# EAGLE schematic Politeitonsirene_V1 (EAGLE 7.7.0)
ABTEILUNG: Technische Informatik; BEARBEITER: Andrej Tica; DOKUMENTART: Schaltplan; GEZ: TicA; ID: 2AHEL; STATUS: Prototyp; VER: 1.0
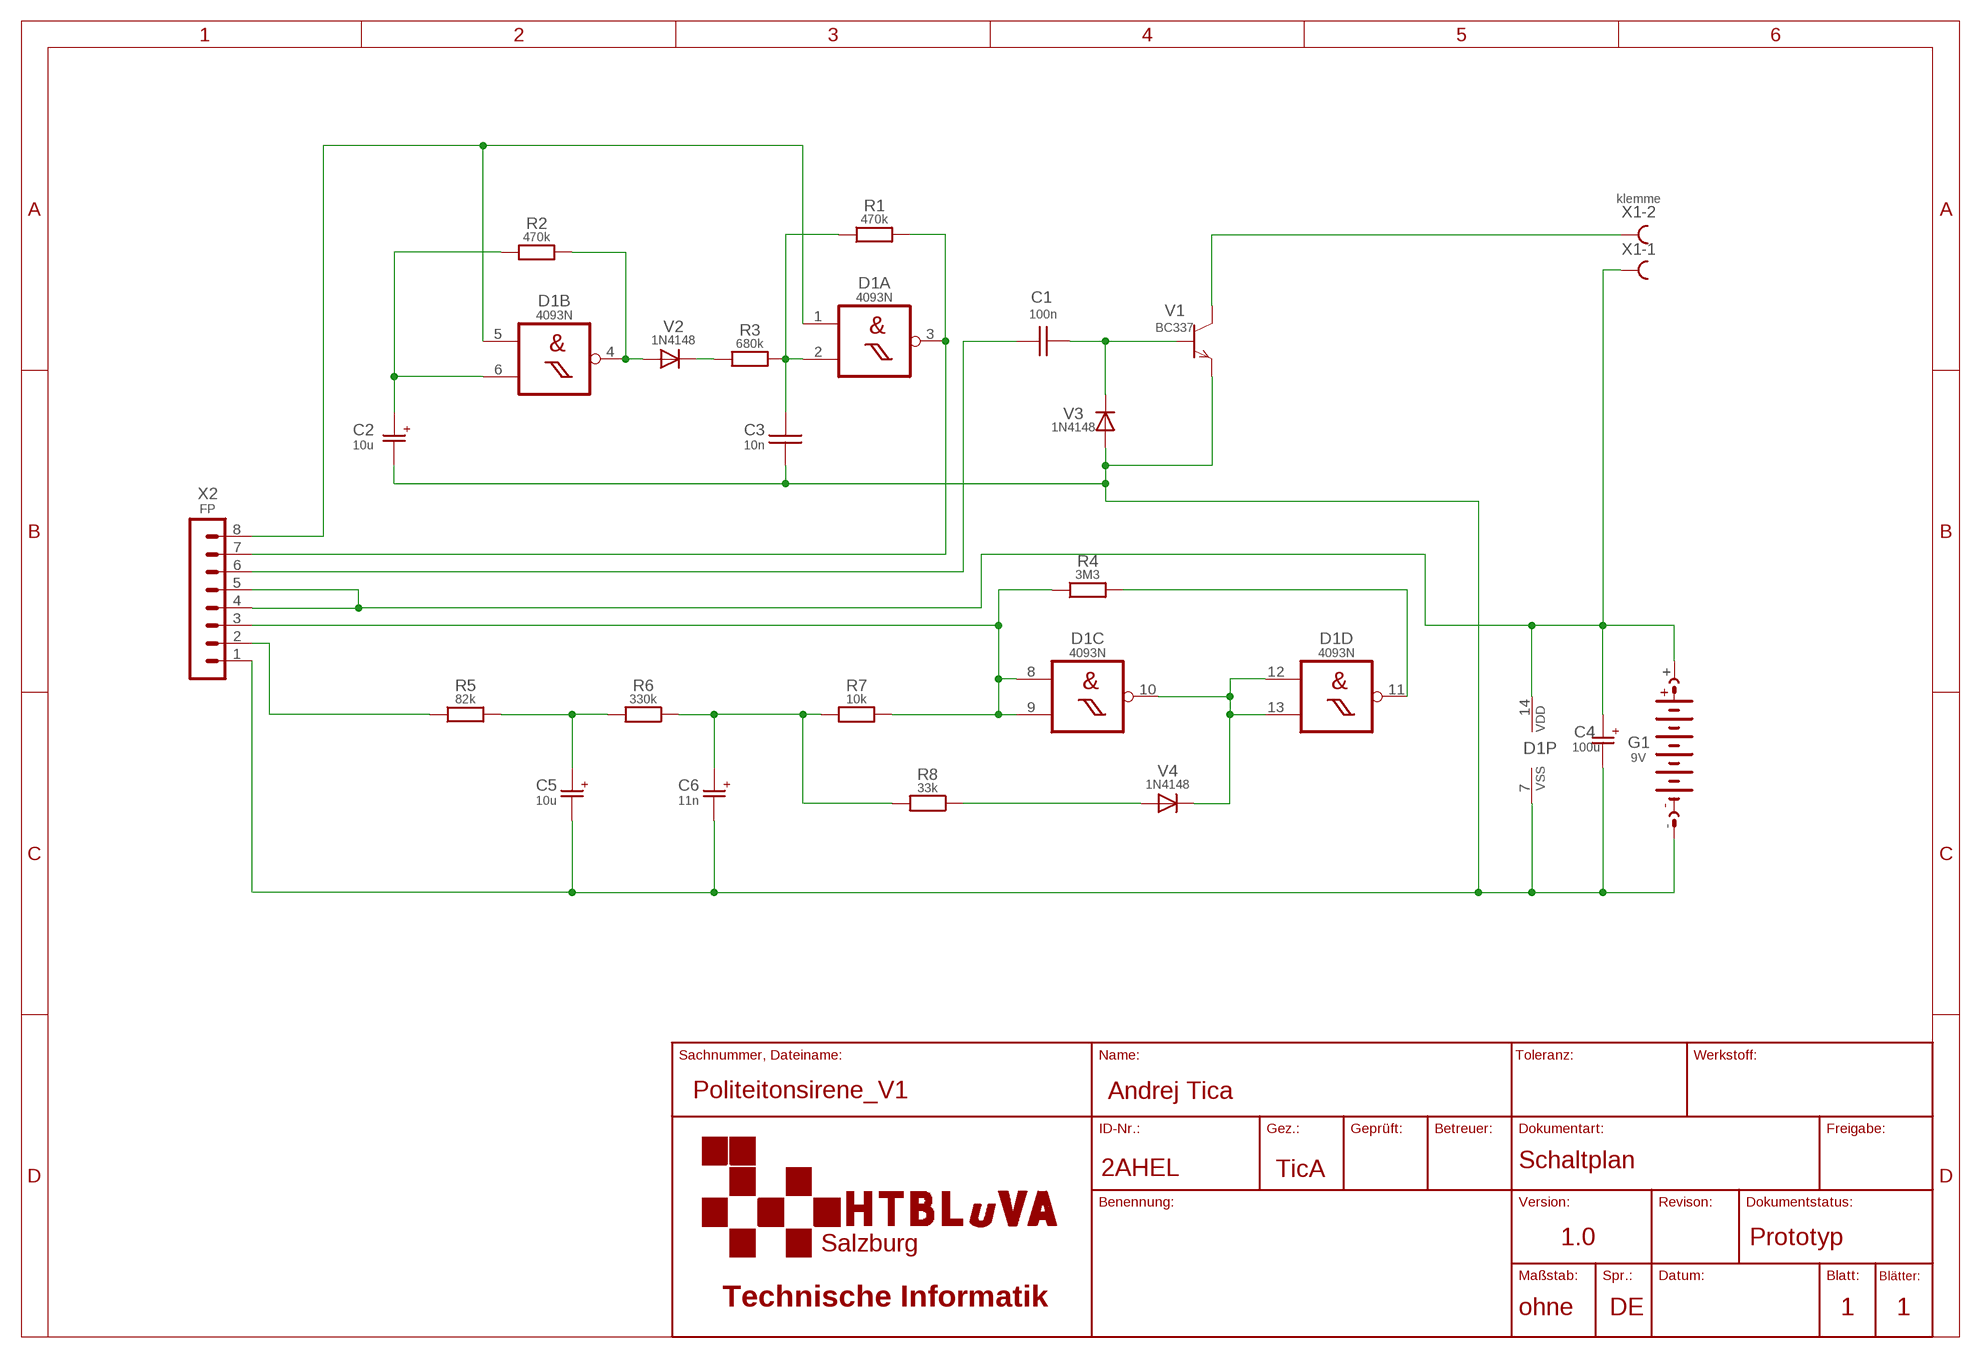
[diagram p0: schematic, sheet 1]

## Parts
C1  100n  C-V_C1206  [C1206]
C2  10u  CPOL-V_E2.5-5  [E2,5-5]
C3  10n  C-V_050-024X044  [C050-024X044]
C4  100u  CPOL-V_E2.5-6  [E2,5-6]
C5  10u  CPOL-V_E2.5-5  [E2,5-5]
C6  11n  CPOL-V_E2.5-5  [E2,5-5]
D1  4093N  [DIL14]
G1  9V  BATCLIP-9V-V_9V  [AB9V]
R1  470k  R-H_R2512  [R2512]
R2  470k  R-H_R2512  [R2512]
R3  680k  R-H_R2512  [R2512]
R4  3M3  R-H_R2512  [R2512]
R5  82k  R-H_R2512  [R2512]
R6  330k  R-H_R2512  [R2512]
R7  10k  R-H_R2512  [R2512]
R8  33k  R-H_R2512  [R2512]
V1  BC337  [TO92]
V2  1N4148  1N4148_DO35-7  [DO35-7]
V3  1N4148  1N4148_DO35-7  [DO35-7]
V4  1N4148  1N4148_DO35-7  [DO35-7]
X1  klemme  AK500/2  [AK500/2]
X2  FP  MA08-1  [MA08-1]

## Nets
GND: C2.- C3.2 C4.- C5.- C6.- D1.7(P:VSS) G1.- V1.1(E) V3.A X2.1
N$1: C3.1 D1.2(A:I1) R1.1 R3.2
N$2: R3.1 V2.C
N$3: D1.4(B:O) R2.2 V2.A
N$4: D1.3(A:O) R1.2 X2.7
N$5: C2.+ D1.6(B:I1) R2.1
N$6: C6.+ R6.1 R7.2 R8.2
N$7: C5.+ R5.2 R6.2
N$9: D1.8(C:I0) D1.9(C:I1) R4.1 R7.1 X2.3
N$10: D1.11(D:O) R4.2
N$11: D1.10(C:O) D1.12(D:I0) D1.13(D:I1) V4.C
N$12: R8.1 V4.A
N$13: C1.1 V1.2(B) V3.C
N$14: V1.3(C) X1.2
N$15: D1.1(A:I0) D1.5(B:I0) X2.8
N$18: C1.2 X2.6
N$19: R5.1 X2.2
VDD: C4.+ D1.14(P:VDD) G1.+ X1.1 X2.4 X2.5

## Library data of the parts
C1 = rcl_StaK:C-V_: CAPACITOR, European symbol
C2 C4-C6 = rcl_StaK:CPOL-V_: POLARIZED CAPACITOR, European symbol
C3 = rcl_TicA:C-V_: CAPACITOR, European symbol
D1 = ic-logik_StaK:4093: Quad 2-input NAND schmitt trigger
G1 = battery_StaK:BATCLIP-9V-V_: 9-V BATTERY CLIP
R1-R8 = rcl_StaK:R-H_: RESISTOR, European symbol
V1 = transistor_StaK:BC337*: NPN Transistor
V2-V4 = diode_StaK:1N4148_: DIODE high speed (Philips)
X1 = con_StaK:AK500/2: CONNECTOR; OC_FARNELL: unknown; OC_NEWARK: unknown
X2 = con_StaK:MA08-1: PIN HEADER; OC_FARNELL: unknown; OC_NEWARK: unknown